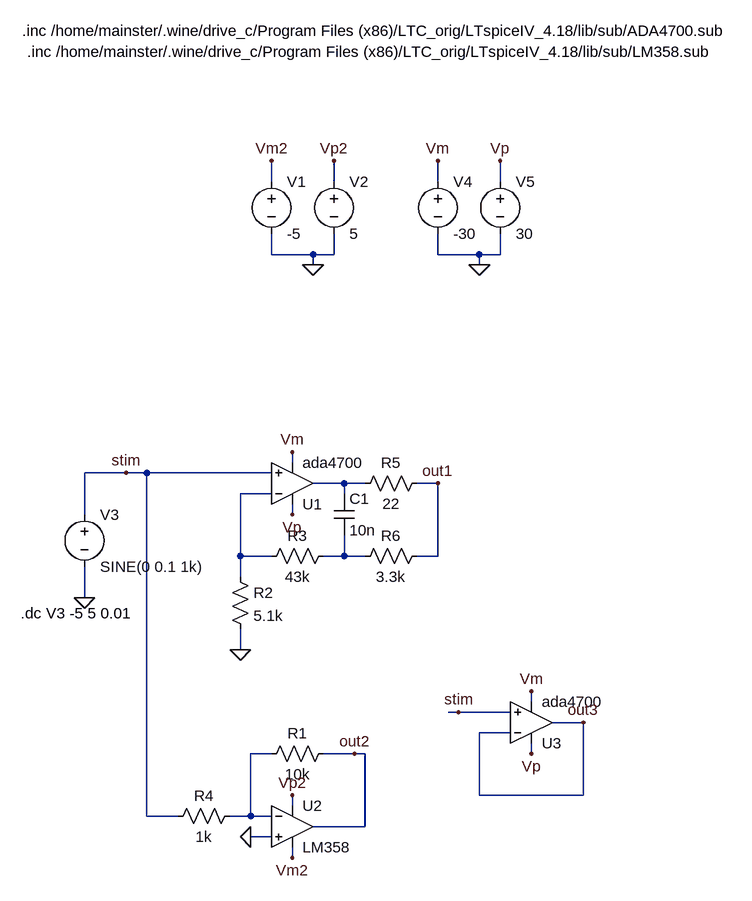
[diagram p0: schematic ADA4700_hv_opamp.asc]
ADA4700_hv_opamp.asc, the LTspice schematic file:
Version 4
SHEET 1 4408 6248
WIRE 192 -64 192 -96
WIRE 288 -64 288 -96
WIRE 448 -64 448 -96
WIRE 544 -64 544 -96
WIRE 192 48 192 16
WIRE 256 48 192 48
WIRE 288 48 288 16
WIRE 288 48 256 48
WIRE 448 48 448 16
WIRE 512 48 448 48
WIRE 544 48 544 16
WIRE 544 48 512 48
WIRE 256 64 256 48
WIRE 512 64 512 48
WIRE 224 368 224 352
WIRE -32 384 -96 384
WIRE 0 384 -32 384
WIRE 192 384 0 384
WIRE 304 400 256 400
WIRE 336 400 304 400
WIRE 448 400 416 400
WIRE 192 416 144 416
WIRE 304 416 304 400
WIRE -96 448 -96 384
WIRE 224 448 224 432
WIRE 144 512 144 416
WIRE 192 512 144 512
WIRE 304 512 304 480
WIRE 304 512 272 512
WIRE 336 512 304 512
WIRE 448 512 448 400
WIRE 448 512 416 512
WIRE 144 544 144 512
WIRE -96 576 -96 528
WIRE 144 656 144 624
WIRE 592 736 592 720
WIRE 480 752 464 752
WIRE 560 752 480 752
WIRE 672 768 624 768
WIRE 560 784 512 784
WIRE 192 816 160 816
WIRE 320 816 272 816
WIRE 336 816 320 816
WIRE 592 816 592 800
WIRE 512 880 512 784
WIRE 672 880 672 768
WIRE 672 880 512 880
WIRE 224 896 224 880
WIRE 0 912 0 384
WIRE 48 912 0 912
WIRE 160 912 160 816
WIRE 160 912 128 912
WIRE 192 912 160 912
WIRE 336 928 336 816
WIRE 336 928 256 928
WIRE 192 944 160 944
WIRE 224 976 224 960
FLAG 256 64 0
FLAG 288 -96 Vp2
FLAG 192 -96 Vm2
FLAG 224 352 Vm
FLAG 224 448 Vp
FLAG -96 576 0
FLAG 224 880 Vp2
FLAG 160 944 0
FLAG 320 816 out2
FLAG 224 976 Vm2
FLAG 512 64 0
FLAG 544 -96 Vp
FLAG 448 -96 Vm
FLAG 144 656 0
FLAG 448 400 out1
FLAG 592 720 Vm
FLAG 592 816 Vp
FLAG 480 752 stim
FLAG -32 384 stim
FLAG 672 768 out3
SYMBOL Opamps\\opamp2 224 464 M180
SYMATTR InstName U1
SYMATTR Value ada4700
SYMATTR SpiceModel ada4700
SYMBOL voltage 192 -80 R0
WINDOW 123 0 0 Left 2
WINDOW 39 0 0 Left 2
SYMATTR InstName V1
SYMATTR Value -5
SYMBOL voltage 288 -80 R0
WINDOW 123 0 0 Left 2
WINDOW 39 0 0 Left 2
SYMATTR InstName V2
SYMATTR Value 5
SYMBOL voltage -96 432 R0
WINDOW 123 0 0 Left 2
WINDOW 39 0 0 Left 2
SYMATTR InstName V3
SYMATTR Value SINE(0 0.1 1k)
SYMBOL Opamps\\opamp2 224 864 R0
SYMATTR InstName U2
SYMATTR Value LM358
SYMATTR SpiceModel LM358
SYMBOL res 176 832 R270
WINDOW 0 32 56 VTop 2
WINDOW 3 0 56 VBottom 2
SYMATTR InstName R1
SYMATTR Value 10k
SYMBOL res 32 928 R270
WINDOW 0 32 56 VTop 2
WINDOW 3 0 56 VBottom 2
SYMATTR InstName R4
SYMATTR Value 1k
SYMBOL voltage 448 -80 R0
WINDOW 123 0 0 Left 2
WINDOW 39 0 0 Left 2
SYMATTR InstName V4
SYMATTR Value -30
SYMBOL voltage 544 -80 R0
WINDOW 123 0 0 Left 2
WINDOW 39 0 0 Left 2
SYMATTR InstName V5
SYMATTR Value 30
SYMBOL res 128 528 R0
SYMATTR InstName R2
SYMATTR Value 5.1k
SYMBOL res 288 496 R90
WINDOW 0 0 56 VBottom 2
WINDOW 3 32 56 VTop 2
SYMATTR InstName R3
SYMATTR Value 43k
SYMBOL res 432 384 R90
WINDOW 0 0 56 VBottom 2
WINDOW 3 32 56 VTop 2
SYMATTR InstName R5
SYMATTR Value 22
SYMBOL res 432 496 R90
WINDOW 0 0 56 VBottom 2
WINDOW 3 32 56 VTop 2
SYMATTR InstName R6
SYMATTR Value 3.3k
SYMBOL cap 288 416 R0
SYMATTR InstName C1
SYMATTR Value 10n
SYMBOL Opamps\\opamp2 592 832 M180
SYMATTR InstName U3
SYMATTR Value ada4700
SYMATTR SpiceModel ada4700
TEXT -192 -296 Left 2 !.inc /home/mainster/.wine/drive_c/Program Files (x86)/LTC_orig/LTspiceIV_4.18/lib/sub/ADA4700.sub
TEXT -194 600 Left 2 !.dc V3 -5 5 0.01
TEXT -184 -264 Left 2 !.inc /home/mainster/.wine/drive_c/Program Files (x86)/LTC_orig/LTspiceIV_4.18/lib/sub/LM358.sub

The netlist it stands for:
* ADA4700_hv_opamp.asc
XU1 stim N002 Vp Vm N001 ada4700 ada4700  ; pins In+ In- V+ V- OUT
V1 Vm2 0 -5
V2 Vp2 0 5
V3 stim 0 SINE(0 0.1 1k)
XU2 0 N004 Vp2 Vm2 out2 LM358 LM358  ; pins In+ In- V+ V- OUT
R1 N004 out2 10k
R4 stim N004 1k
V4 Vm 0 -30
V5 Vp 0 30
R2 N002 0 5.1k
R3 N003 N002 43k
R5 out1 N001 22
R6 out1 N003 3.3k
C1 N001 N003 10n
XU3 stim out3 Vp Vm out3 ada4700 ada4700  ; pins In+ In- V+ V- OUT
.inc /home/mainster/.wine/drive_c/Program Files (x86)/LTC_orig/LTspiceIV_4.18/lib/sub/ADA4700.sub
.dc V3 -5 5 0.01
.inc /home/mainster/.wine/drive_c/Program Files (x86)/LTC_orig/LTspiceIV_4.18/lib/sub/LM358.sub
.backanno
.end